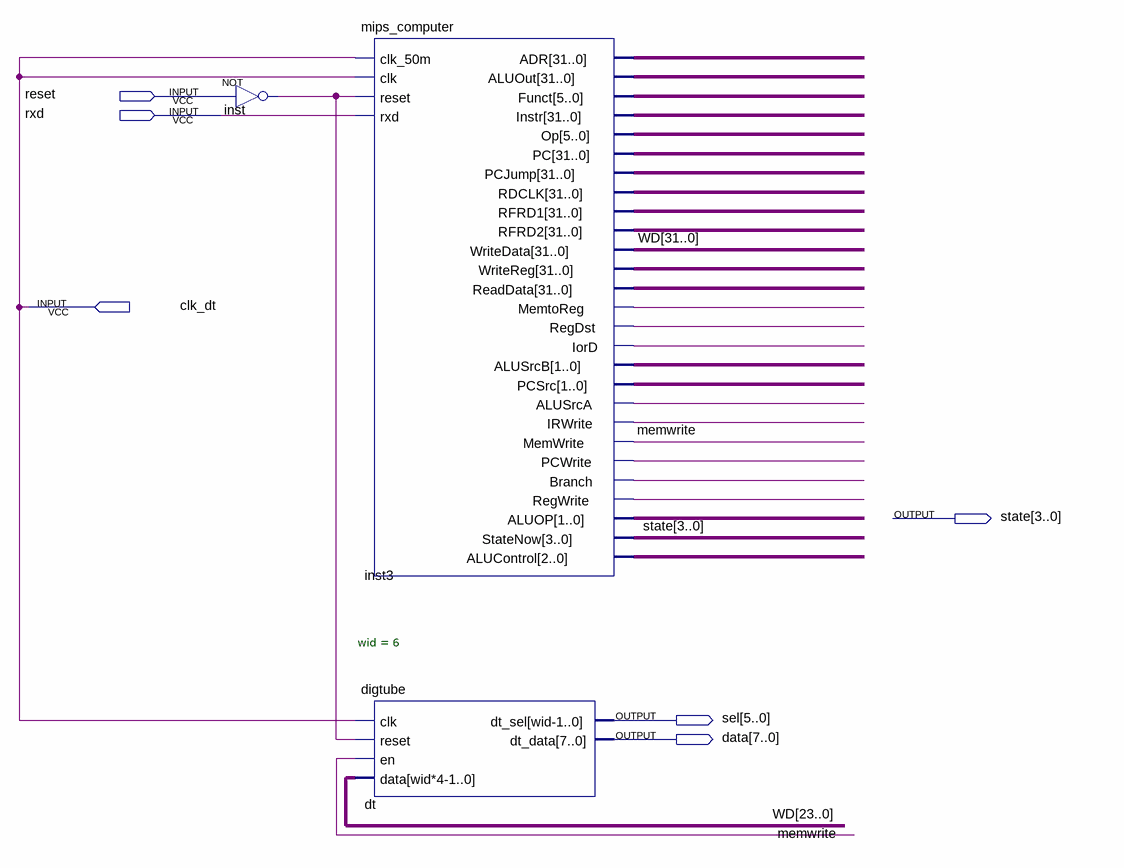
[diagram p0: schematic sheet]
// Quartus schematic mips_fpga.bdf as structural Verilog: 3 symbols, 6 pins
module mips_fpga (
  input  reset,
  input  rxd,
  input  clk_dt,
  output [3:0] state,
  output [5:0] sel,
  output [7:0] data
);

  wire inst3_alusrca, inst3_branch, inst3_iord, inst3_irwrite, inst3_memtoreg, inst3_pcwrite, inst3_regdst,
       inst3_regwrite, inst_out, memwrite;
  wire [1:0] inst3_aluop, inst3_alusrcb, inst3_pcsrc;
  wire [2:0] inst3_alucontrol;
  wire [5:0] inst3_funct, inst3_op;
  wire [31:0] inst3_adr, inst3_aluout, inst3_instr, inst3_pc, inst3_pcjump, inst3_rdclk, inst3_readdata,
       inst3_rfrd1, inst3_rfrd2, inst3_writereg, WD;

  not inst (inst_out, reset);
  mips_computer inst3 (
    .clk_50m(clk_dt), .clk(clk_dt), .reset(inst_out), .rxd(rxd), .ADR(inst3_adr), .ALUOut(inst3_aluout),
    .Funct(inst3_funct), .Instr(inst3_instr), .Op(inst3_op), .PC(inst3_pc), .PCJump(inst3_pcjump),
    .RDCLK(inst3_rdclk), .RFRD1(inst3_rfrd1), .RFRD2(inst3_rfrd2), .WriteData(WD), .WriteReg(inst3_writereg),
    .ReadData(inst3_readdata), .MemtoReg(inst3_memtoreg), .RegDst(inst3_regdst), .IorD(inst3_iord),
    .ALUSrcB(inst3_alusrcb), .PCSrc(inst3_pcsrc), .ALUSrcA(inst3_alusrca), .IRWrite(inst3_irwrite),
    .MemWrite(memwrite), .PCWrite(inst3_pcwrite), .Branch(inst3_branch), .RegWrite(inst3_regwrite),
    .ALUOP(inst3_aluop), .StateNow(state), .ALUControl(inst3_alucontrol));
  digtube #(.wid(6)) dt (.clk(clk_dt), .reset(inst_out), .en(memwrite), .data(WD[23:0]), .dt_sel(sel), .dt_data(data));
endmodule
